# EAGLE design Emat (EAGLE 7.5.0)
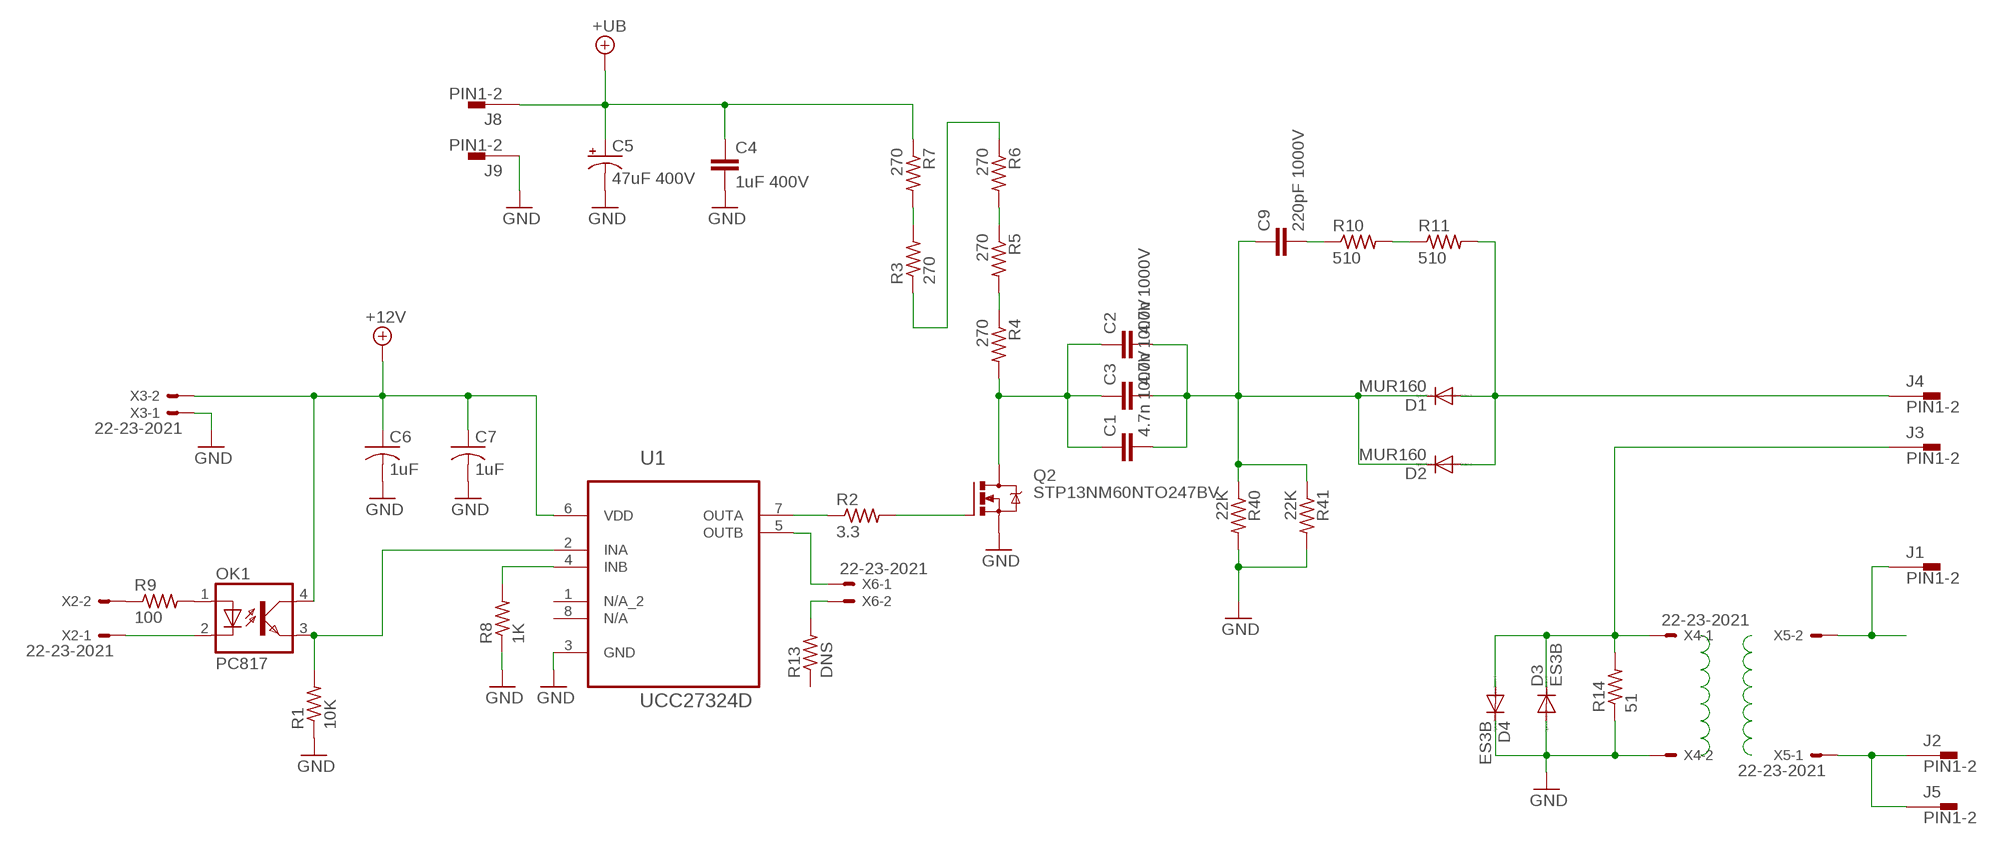
[diagram p0: schematic, sheet 1]

## Parts
C1  4.7n 1000V  C10/4  [C10B4]
C2  4.7n 1000V  C10/4  [C10B4]
C3  4.7n 1000V  C10/4  [C10B4]
C4  1uF 400V  C27/13  [C27.5B13]
C5  47uF 400V  CPOL-USSANYO_G  [SANYO-OSCON_G]
C6  1uF  C-USC0805  [C0805]
C7  1uF  C-USC0805  [C0805]
C9  220pF 1000V  C-EU075-042X103  [C075-042X103]
D1  MUR160  [DO41-10]
D2  MUR160  [DO41-10]
D3  ES3B  DIODE-SMC  [SMC]
D4  ES3B  DIODE-SMC  [SMC]
J1  PIN1-2  [62221]
J2  PIN1-2  [62221]
J3  PIN1-2  [62221]
J4  PIN1-2  [62221]
J5  PIN1-2  [62221]
J8  PIN1-2  [62221]
J9  PIN1-2  [62221]
OK1  PC817  [DIL04]
Q2  STP13NM60NTO247BV  [TO247BV]
R1  10K  R-US_R1206  [R1206]
R2  3.3  R-US_R1206  [R1206]
R3  270  R-US_R2512  [R2512]
R4  270  R-US_R2512  [R2512]
R5  270  R-US_R2512  [R2512]
R6  270  R-US_R2512  [R2512]
R7  270  R-US_R2512  [R2512]
R8  1K  R-US_R1206  [R1206]
R9  100  R-US_R1206  [R1206]
R10  510  R-US_R1206  [R1206]
R11  510  R-US_R1206  [R1206]
R13  DNS  R-US_R1206  [R1206]
R14  51  R-US_R1206  [R1206]
R40  22K  R-US_R2512  [R2512]
R41  22K  R-US_R2512  [R2512]
U1  UCC27324D  [SOIC127P600X175-8N]
X2  22-23-2021  [22-23-2021]
X3  22-23-2021  [22-23-2021]
X4  22-23-2021  [22-23-2021]
X5  22-23-2021  [22-23-2021]
X6  22-23-2021  [22-23-2021]

## Nets
+12V: C6.1 C7.1 OK1.4(COL) U1.6(VDD) X3.2
+UB: C4.1 C5.+ J8.1 R7.1
GND: C4.2 C5.- C6.2 C7.2 D3.A D4.C J9.1 Q2.S R1.1 R8.1 R14.1 R40.2 R41.2 U1.3(GND) X3.1 X4.2
N$1: OK1.3(EMIT) R1.2 U1.2(INA)
N$2: R2.1 U1.7(OUTA)
N$3: Q2.G R2.2
N$4: C1.1 C2.1 C3.1 Q2.D R4.2
N$6: R4.1 R5.2
N$7: R5.1 R6.2
N$8: R3.1 R6.1
N$9: R3.2 R7.2
N$10: J1.1 X5.2
N$11: R8.2 U1.4(INB)
N$12: U1.5(OUTB) X6.1
N$13: C9.2 R10.1
N$14: R10.2 R11.1
N$15: D1.A D2.A J4.1 R11.2
N$16: C1.2 C2.2 C3.2 C9.1 D1.C D2.C R40.1 R41.1
N$17: OK1.1(A) R9.2
N$18: R9.1 X2.2
N$19: OK1.2(C) X2.1
N$20: D3.C D4.A J3.1 R14.2 X4.1
N$21: R13.2 X6.2
N$22: J2.1 J5.1 X5.1
Unconnected: R13.1 U1.1(N/A_2) U1.8(N/A)

## Library data of the parts
C1-C4 = capacitor-wima:C: CAPACITOR naming: grid - package width
C5 = rcl:CPOL-US: POLARIZED CAPACITOR, American symbol
C6 C7 = rcl:C-US: CAPACITOR, American symbol
C9 = rcl:C-EU: CAPACITOR, European symbol
D1 D2 = diode:MUR160: DIODE
D3 D4 = diode:DIODE-: DIODE
J1-J5 J8 J9 = con-faston:PIN1-2: CONN TAB FASTON BRASS .187 PCB TAB, FSSTON, DUAL STAKE, .187 SERIES Digi-Key Part Number: A24734CT-ND Source: Tyco Electronics Corporation .. ENG_CD_62221_R.pdf http://search.digikey.com/scripts/DkSearch/dksus.dll?Detail&name=A24734CT-ND; MF: TYCO ELECTRONICS; MPN: 62221-1; OC_FARNELL: unknown; OC_NEWARK: 16H2318
OK1 = optocoupler:PC817: SHARP OPTO COUPLER; MPN: PC817X4J000F; OC_FARNELL: 9707727; OC_NEWARK: 97K7059
Q2 = transistor-power:STP13NM60N: N-CHANNEL MOS FET
R1 R2 R8-R11 R13 R14 R40 R41 = rcl:R-US_: RESISTOR, American symbol
R3-R7 = resistor:R-US_: RESISTOR, American symbol
U1 = UCC27324D:UCC27324D: DUAL 4-A PEAK HIGH SPEED LOW- SIDE POWER MOSFET DRIVERS
X2-X6 = con-molex:22-23-2021: .100" (2.54mm) Center Header - 2 Pin; MF: MOLEX; MPN: 22-23-2021; OC_FARNELL: 1462926; OC_NEWARK: 25C3832

## Board
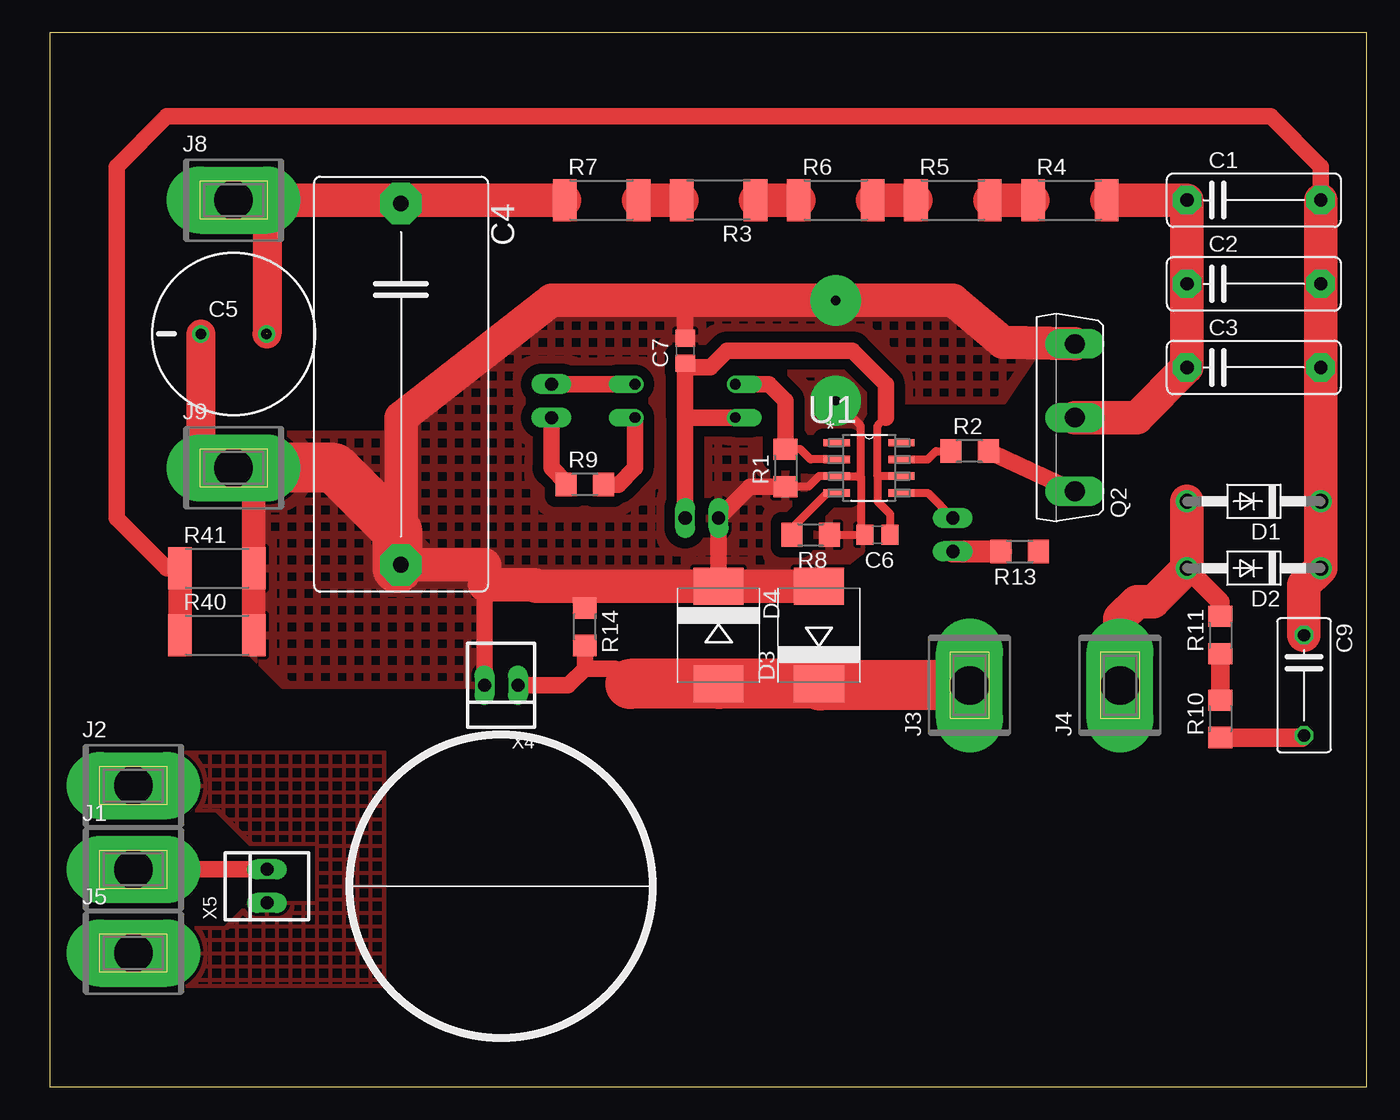
[diagram p1: board, top side]
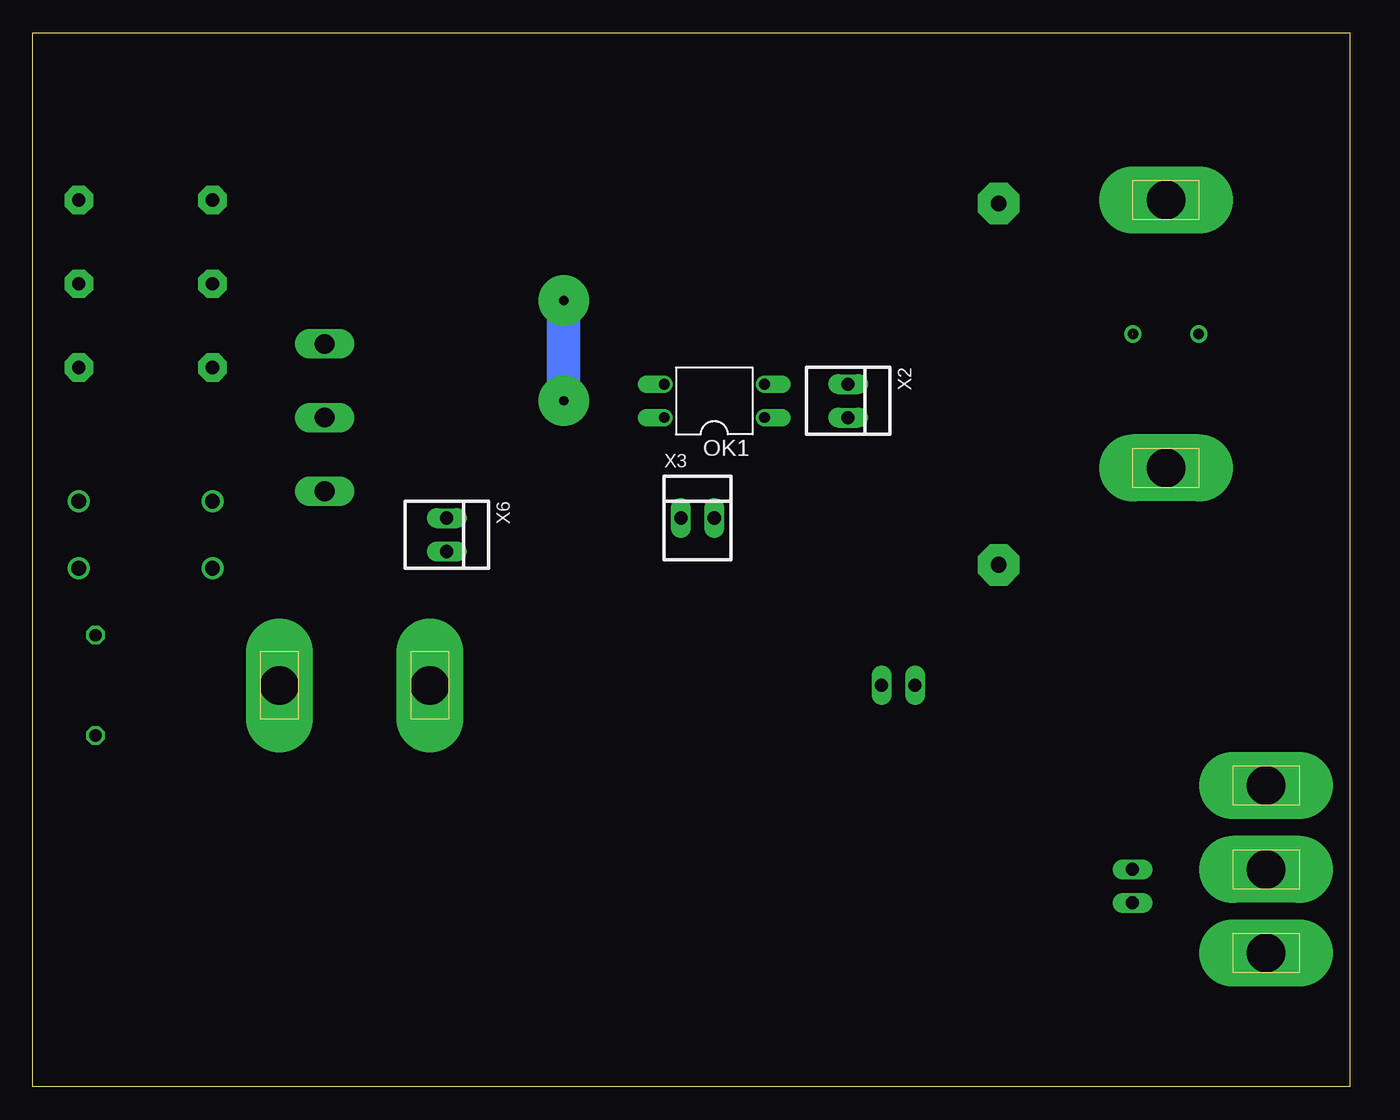
[diagram p2: board, bottom side, seen from below]

Size 100 x 80 mm. Coordinates in mm from the lower left corner, seen from the top.
Outline: 0,0 100,0 100,80 0,80 0,0
Copper layers (1*16): Top 0.035mm / dielectric 1.5mm / Bottom 0.035mm
Design rules "default": minimum track width 10mil, minimum drill 24mil, track to track 8mil, track to pad 8mil, pad to pad 8mil, via to via 8mil, smd to smd 8mil, copper to edge 40mil, drill to drill 8mil, minimum pad ring 10mil, minimum via ring 8mil, stop-mask expansion 4mil, vias tented up to drill 0mil, thermal gap 10mil

### Footprints (pad centres in the part's own frame; a part is rotated, then mirrored left to right if it is on the bottom)
C10B4 = drill 1.016 pad 2.159 octagon: 1 -5.08,0; 2 5.08,0
C27.5B13 = drill 1.194 pad 3.15 octagon: 1 -13.716,0; 2 13.716,0
SANYO-OSCON_G = drill 0.8 pad 1.27: + 2.5,0; - -2.5,0
C0805 = smd 1.3 x 1.5: 1 -0.95,0; 2 0.95,0
C075-042X103 = drill 0.914 octagon: 1 -3.81,0; 2 3.81,0
DO41-10 = drill 1.118: A 5.08,0; C -5.08,0
SMC = smd 2.8 x 3.8: A 3.7,0; C -3.7,0
62221 = drill 2.921 pad 5.08 long: 1 0,0
DIL04 = drill 0.813 offset: 1 -1.27,-3.81; 2 1.27,-3.81; 3 1.27,3.81; 4 -1.27,3.81
TO247BV = drill 1.499 long: D 0,-2.921; G -5.588,-2.921; S 5.588,-2.921
R1206 = smd 1.6 x 1.803: 1 -1.422,0; 2 1.422,0
R2512 = smd 1.8 x 3.2: 1 -2.8,0; 2 2.8,0
SOIC127P600X175-8N = smd 1.981 x 0.559: 1 -2.464,1.905; 2 -2.464,0.635; 3 -2.464,-0.635; 4 -2.464,-1.905; 5 2.464,-1.905; 6 2.464,-0.635; 7 2.464,0.635; 8 2.464,1.905
22-23-2021 = drill 1 long: 1 -1.27,0; 2 1.27,0

### Placement (x,y rotation side)
C1  91.44,67.31 0 top
C2  91.44,60.96 0 top
C3  91.44,54.61 0 top
C4  26.67,53.34 270 top
C5  13.97,57.15 0 top
C6  62.87,41.91 180 top
C7  48.26,55.88 90 top
C9  95.25,30.48 270 top
D1  91.44,44.45 180 top
D2  91.44,39.37 180 top
D3  58.42,34.29 90 top
D4  50.8,34.29 270 top
J1  6.35,16.51 0 top
J2  6.35,22.86 0 top
J3  69.85,30.48 90 top
J4  81.28,30.48 90 top
J5  6.35,10.16 0 top
J8  13.97,67.31 0 top
J9  13.97,46.99 0 top
OK1  48.26,52.07 90 bottom
Q2  74.93,50.8 90 top
R1  55.88,46.99 90 top
R2  69.85,48.26 0 top
R3  50.8,67.31 180 top
R4  77.47,67.31 0 top
R5  68.58,67.31 0 top
R6  59.69,67.31 0 top
R7  41.91,67.31 0 top
R8  57.78,41.91 180 top
R9  40.64,45.72 0 top
R10  88.9,27.94 90 top
R11  88.9,34.29 90 top
R13  73.66,40.64 180 top
R14  40.64,34.92 270 top
R40  12.7,34.29 0 top
R41  12.7,39.37 0 top
U1  62.23,46.99 0 top
X2  38.1,52.07 270 bottom
X3  49.53,43.18 0 bottom
X4  34.29,30.48 180 top
X5  16.51,15.24 90 top
X6  68.58,41.91 270 bottom

### Tracks (layer width: path | path; a pad name or v marks a point on that pad's centre or on a via)
+12V
  Top 0.61: 62.87,46.35 62.87,50.16 63.5,50.8 | U1.6 62.87,46.35 | 62.87,46.35 62.87,44.45 63.81,43.5 C6.1
  Top 1.27: 48.26,50.8 X3.2 | OK1.4 48.26,50.8 | 48.26,50.8 C7.1 48.58,54.61 50.16,54.61 51.44,55.88 60.96,55.88 63.5,53.34 63.5,50.8
+UB  (1 unrouted)
  Top 1.778: J8.1 16.51,67.31
  Top 2.184: 16.51,67.31 16.51,57.15
  Top 2.54: J8.1 26.42,67.31 C4.1 26.92,67.31 R7.1
GND  (via drill 0.7 pad 3.81)
  Top 0.61: R1.1 57.63,45.57 58.42,46.35 U1.3 61.59,46.35 | 61.59,46.35 61.59,42.55 61.91,42.23 C6.2 R8.1 | 61.59,46.35 61.59,50.16 v59.69,52.07
  Top 1.27: D4.C X3.1 53.19,45.57 R1.1 | C7.2 48.26,59.69 | X4.2 33.02,38.1 33.02,39.63 | R14.1 40.64,37.99
  Top 1.778: 11.47,47.03 11.43,46.99 J9.1 15.24,46.99 15.5,46.73 R41.2 R40.2 | 26.42,39.37 C4.2
  Top 2.184: C5.- 11.47,47.03
  Top 2.54: D3.A D4.C 40.64,37.99 36.94,37.99 36.83,38.1 33.02,38.1 | Q2.S 72.39,56.52 68.58,59.69 v59.69,59.69 48.26,59.69 38.1,59.69 26.67,50.8 C4.2 29.2,39.63 33.02,39.63
  Top 3.81: 26.42,39.37 26.42,42.16 21.59,46.99 J9.1
  Bottom 2.54: v59.69,59.69 v59.69,52.07
  pour Top (isolate 0.813, hatched): 26.67,39.37 26.67,50.8 38.1,59.69 67.31,59.69 74.93,55.88 72.39,52.07 63.5,52.07 61.59,48.9 61.59,40.64 58.42,38.1 37.47,38.1 33.02,38.73
  pour Top (isolate 0.813, hatched): 15.24,49.53 26.67,49.53 26.67,39.37 33.02,39.37 33.02,30.48 17.78,30.48 15.24,33.02
N$1
  Top 0.61: U1.2 57.78,47.62 57,48.41 R1.2
  Top 1.27: OK1.3 54.61,53.34 55.88,52.07 R1.2
N$2
  Top 0.61: U1.7 66.67,47.62 67.31,48.26 R2.1
N$3
  Top 1.27: R2.2 Q2.G
N$4
  Top 2.54: R4.2 C1.1 C2.1 C3.1 82.55,50.8 Q2.D
N$5
  pour Top: 26.67,39.37 26.67,41.91 21.59,46.99
N$6
  Top 2.54: R5.2 R4.1
N$7
  Top 2.54: R6.2 R5.1
N$8
  Top 2.54: R3.1 R6.1
N$9
  Top 2.54: R7.2 R3.2
N$10
  Top 1.27: X5.2 J1.1
N$11
  Top 0.61: U1.4 59.05,45.09 56.52,42.55 56.52,42.06 R8.2
N$12
  Top 0.61: U1.5 66.67,45.09 X6.1
N$13
  Top 1.422: R10.1 95.1,26.52 C9.2
N$14
  Top 1.422: R10.2 R11.1
N$15
  Top 1.422: R11.2 88.9,36.83 D2.A
  Top 2.54: J4.1 81.28,35.56 82.55,36.83 83.82,36.83 D2.A D1.A
N$16
  Top 1.27: R41.1 8.89,39.37 5.08,43.18 5.08,69.85 8.89,73.66 92.71,73.66 96.52,69.85 C1.2
  Top 1.778: R40.1 R41.1
  Top 2.54: C1.2 C2.2 C3.2 D1.C D2.C 95.25,38.1 C9.1
N$17
  Top 1.27: OK1.1 44.45,46.99 43.18,45.72 R9.2
N$18
  Top 1.27: X2.2 38.1,46.99 39.22,45.87 R9.1
N$19
  Top 1.27: X2.1 OK1.2
N$20
  Top 1.27: X4.1 39.37,30.48 40.64,31.75 | 40.64,31.75 42.92,31.75 44.08,30.59 | R14.2 40.64,31.75
  Top 3.81: J3.1 58.53,30.48 D3.C D4.A 44.08,30.59
N$21
  Top 1.676: X6.2 R13.2
N$22
  pour Top (hatched): 7.62,12.06 13.34,12.06 15.24,13.97 20.32,13.97 20.32,18.41 15.24,18.41 12.7,20.95 7.62,20.95 7.62,25.4 25.4,25.4 25.4,7.62 7.62,7.62